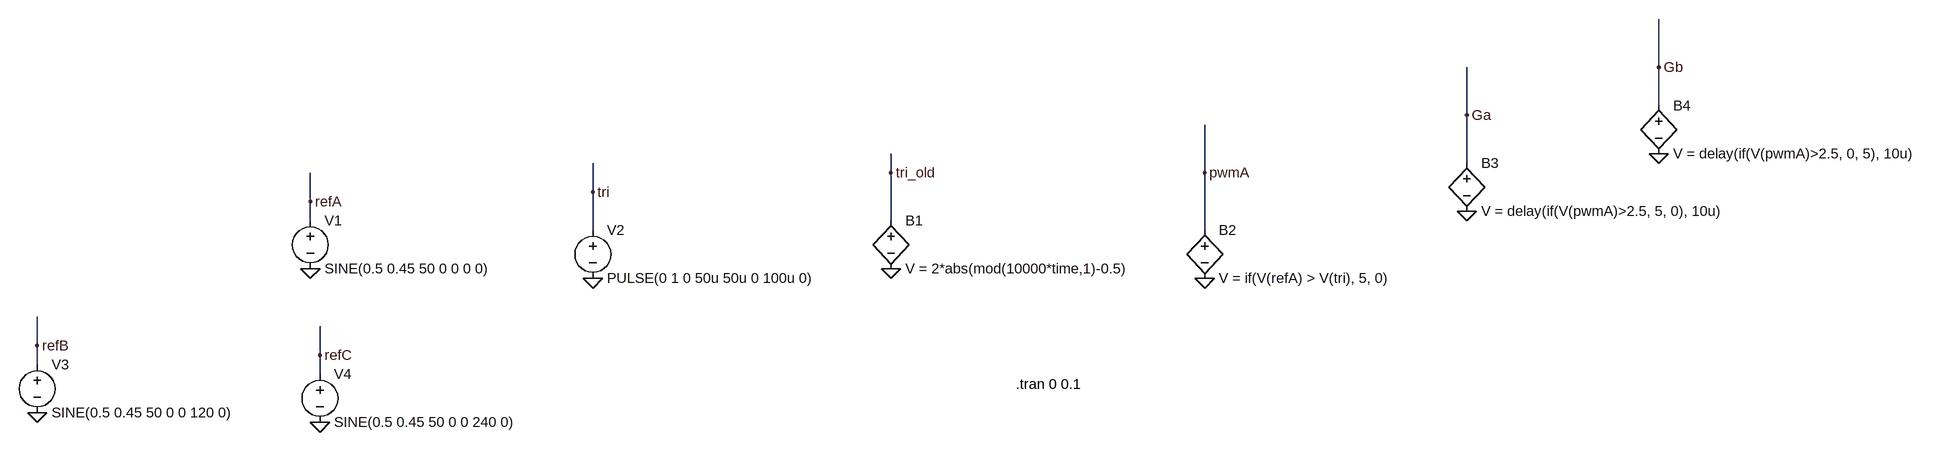
[diagram p0: schematic triangle_carrier.asc]
triangle_carrier.asc, the LTspice schematic file:
Version 4.1
SHEET 1 2836 804
WIRE 1440 192 1440 112
WIRE 1440 256 1440 192
WIRE 1120 272 1120 192
WIRE 1120 352 1120 272
WIRE 0 368 0 336
WIRE 608 368 608 288
WIRE -512 400 -512 352
WIRE -1008 416 -1008 368
WIRE -1008 448 -1008 416
WIRE 0 448 0 368
WIRE -512 464 -512 400
WIRE 608 464 608 368
WIRE -1520 656 -1520 608
WIRE -992 672 -992 624
WIRE -1520 688 -1520 656
WIRE -992 704 -992 672
FLAG 0 528 0
FLAG 0 368 tri_old
FLAG -1008 528 0
FLAG 608 544 0
FLAG -1008 416 refA
FLAG -512 544 0
FLAG -512 400 tri
FLAG 608 368 pwmA
FLAG 1120 432 0
FLAG 1120 272 Ga
FLAG 1440 336 0
FLAG 1440 192 Gb
FLAG -1520 768 0
FLAG -1520 656 refB
FLAG -992 784 0
FLAG -992 672 refC
SYMBOL bv 0 432 R0
SYMATTR InstName B1
SYMATTR Value V = 2*abs(mod(10000*time,1)-0.5)
SYMBOL voltage -1008 432 R0
WINDOW 123 0 0 Left 0
WINDOW 39 0 0 Left 0
SYMATTR InstName V1
SYMATTR Value SINE(0.5 0.45 50 0 0 0 0)
SYMBOL bv 608 448 R0
SYMATTR InstName B2
SYMATTR Value V = if(V(refA) > V(tri), 5, 0)
SYMBOL voltage -512 448 R0
WINDOW 123 0 0 Left 0
WINDOW 39 0 0 Left 0
SYMATTR InstName V2
SYMATTR Value PULSE(0 1 0 50u 50u 0 100u 0)
SYMBOL bv 1120 336 R0
SYMATTR InstName B3
SYMATTR Value V = delay(if(V(pwmA)>2.5, 5, 0), 10u)
SYMBOL bv 1440 240 R0
SYMATTR InstName B4
SYMATTR Value V = delay(if(V(pwmA)>2.5, 0, 5), 10u)
SYMBOL voltage -1520 672 R0
WINDOW 123 0 0 Left 0
WINDOW 39 0 0 Left 0
SYMATTR InstName V3
SYMATTR Value SINE(0.5 0.45 50 0 0 120 0)
SYMBOL voltage -992 688 R0
WINDOW 123 0 0 Left 0
WINDOW 39 0 0 Left 0
SYMATTR InstName V4
SYMATTR Value SINE(0.5 0.45 50 0 0 240 0)
TEXT 208 720 Left 2 !.tran 0 0.1

The netlist it stands for:
* triangle_carrier.asc
B1 tri_old 0 V = 2*abs(mod(10000*time,1)-0.5)
V1 refA 0 SINE(0.5 0.45 50 0 0 0 0)
B2 pwmA 0 V = if(V(refA) > V(tri), 5, 0)
V2 tri 0 PULSE(0 1 0 50u 50u 0 100u 0)
B3 Ga 0 V = delay(if(V(pwmA)>2.5, 5, 0), 10u)
B4 Gb 0 V = delay(if(V(pwmA)>2.5, 0, 5), 10u)
V3 refB 0 SINE(0.5 0.45 50 0 0 120 0)
V4 refC 0 SINE(0.5 0.45 50 0 0 240 0)
.tran 0 0.1
.backanno
.end